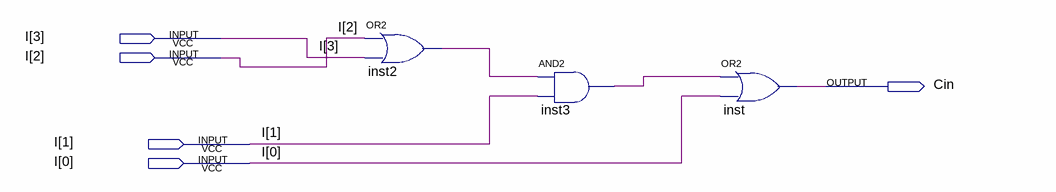
[diagram p0: schematic sheet]
// Quartus schematic CIN.bdf as structural Verilog: 3 symbols, 5 pins
module CIN (
  input  [3:0] I,
  output Cin
);

  wire inst2_out, inst3_out;

  or inst2 (inst2_out, I[2], I[3]);
  and inst3 (inst3_out, inst2_out, I[1]);
  or inst (Cin, inst3_out, I[0]);
endmodule
